# EAGLE design SingleSystem1 (EAGLE 7.7.0)
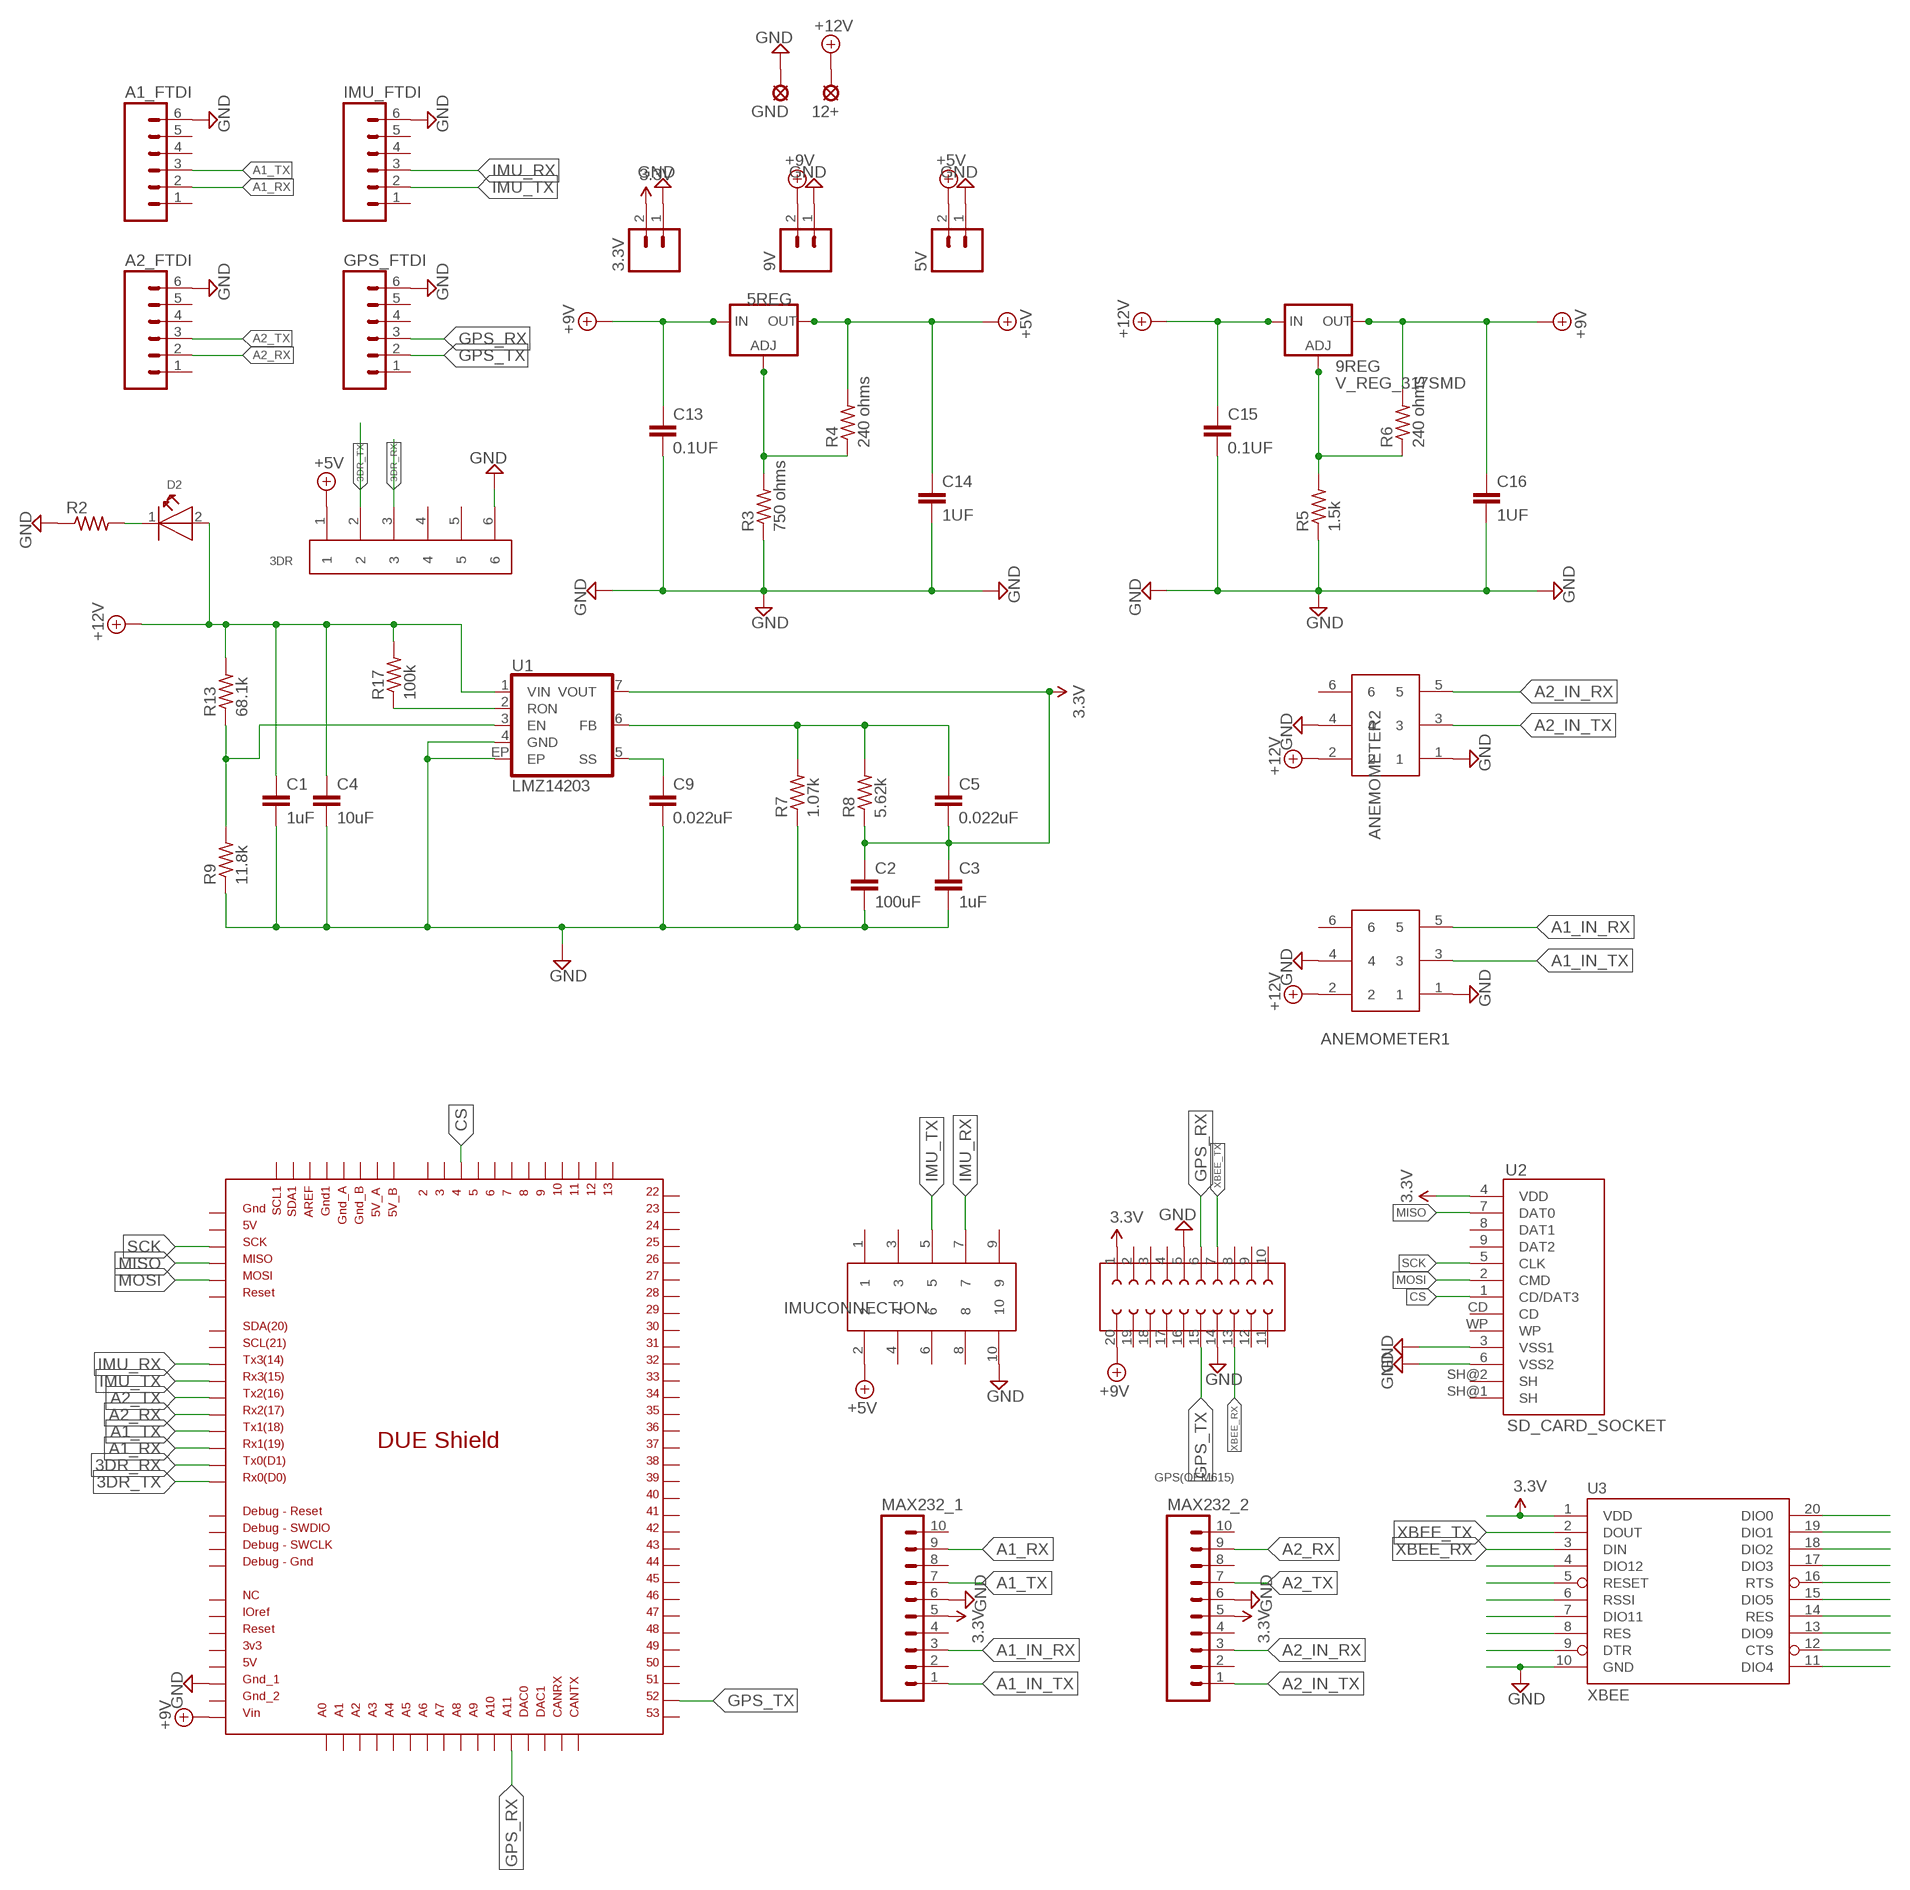
[diagram p0: schematic, sheet 1]

## Parts
3.3V  M02  [02P]
3DR  653006114822  [653006114822]
5REG  V_REG_317SMD  [SOT223]
5V  M02  [02P]
9REG  V_REG_317SMD  [SOT223]
9V  M02  [02P]
12+  SE14  [SE14]
A1_FTDI  M06  [06P]
A2_FTDI  M06  [06P]
ANEMOMETER1  61200622323  [61200622323]
ANEMOMETER2  61200622323  [61200622323]
C1  1uF  1UF-25V-10%(0805)  [0805]
C2  100uF  CAP1206  [1206]
C3  1uF  1UF-25V-10%(0805)  [0805]
C4  10uF  CAP0805  [0805]
C5  0.022uF  CAP0603-CAP  [0603-CAP]
C9  0.022uF  CAP0603-CAP  [0603-CAP]
C13  0.1UF  1UF-25V-10%(0805)  [0805]
C14  1UF  1UF-25V-10%(0805)  [0805]
C15  0.1UF  1UF-25V-10%(0805)  [0805]
C16  1UF  1UF-25V-10%(0805)  [0805]
D2  WL-SMCW-150120BS75000-B  [1206]
GND  SE14  [SE14]
GPS(OEM615)  62002021821  [62002021821]
GPS_FTDI  M06  [06P]
IMU_FTDI  M06  [06P]
IMUCONNECTION  62501021621  [62501021621]
MAX232_1  M10  [10P]
MAX232_2  M10  [10P]
R2  R-US_M2012  [M2012]
R3  750 ohms  R-US_M2012  [M2012]
R4  240 ohms  R-US_M2012  [M2012]
R5  1.5k  R-US_M2012  [M2012]
R6  240 ohms  R-US_M2012  [M2012]
R7  1.07k  R-US_M2012  [M2012]
R8  5.62k  R-US_M2012  [M2012]
R9  11.8k  R-US_M2012  [M2012]
R13  68.1k  R-US_M2012  [M2012]
R17  100k  R-US_M2012  [M2012]
U1  LMZ14203  [TO-PMOD-7]
U2  SD_CARD_SOCKET  [SD_1:1]
U3  XBEE  XBEE-1B1  [XBEE-1]
U$1  DUE(NORMAL)  [DUE(NORMAL)]

## Nets
3.3V: 3.3V.2 C2.1 C3.1 C5.2 GPS(OEM615).1 MAX232_1.5 MAX232_2.5 R8.1 U1.7(VOUT) U2.4(VDD) U3.1(VDD)
3DR_RX [3DR]: 3DR.3 U$1.TX0
3DR_TX [3DR]: 3DR.2 U$1.RX0
+5V: 3DR.1 5REG.2(OUT) 5V.2 C14.1 IMUCONNECTION.2 R4.2
+9V: 5REG.3(IN) 9REG.2(OUT) 9V.2 C13.1 C16.1 GPS(OEM615).20 R6.2 U$1.VIN
+12V: 9REG.3(IN) 12+.MP ANEMOMETER1.2 ANEMOMETER2.2 C1.1 C4.1 C15.1 D2.2(A) R13.2 R17.2 U1.1(VIN)
A1_IN_RX: ANEMOMETER1.5 MAX232_1.3
A1_IN_TX: ANEMOMETER1.3 MAX232_1.1
A1_RX: A1_FTDI.2 MAX232_1.9 U$1.RX1
A1_TX: A1_FTDI.3 MAX232_1.7 U$1.TX1
A2_IN_RX: ANEMOMETER2.5 MAX232_2.3
A2_IN_TX: ANEMOMETER2.3 MAX232_2.1
A2_RX: A2_FTDI.2 MAX232_2.9 U$1.RX2
A2_TX: A2_FTDI.3 MAX232_2.7 U$1.TX2
CS: U2.1(CD/DAT3) U$1.4
GND: 3.3V.1 3DR.6 5V.1 9V.1 A1_FTDI.6 A2_FTDI.6 ANEMOMETER1.1 ANEMOMETER1.4 ANEMOMETER2.1 ANEMOMETER2.4 C1.2 C2.2 C3.2 C4.2 C9.2 C13.2 C14.2 C15.2 C16.2 GND.MP GPS(OEM615).5 GPS(OEM615).14 GPS_FTDI.6 IMU_FTDI.6 IMUCONNECTION.10 MAX232_1.6 MAX232_2.6 R2.1 R3.1 R5.1 R7.1 R9.1 U1.4(GND) U1.EP U2.3(VSS1) U2.6(VSS2) U3.10(GND) U$1.GND_1
GPS_RX: GPS(OEM615).6 GPS_FTDI.3 U$1.A11
GPS_TX: GPS(OEM615).15 GPS_FTDI.2 U$1.52
IMU_RX: IMU_FTDI.3 IMUCONNECTION.7 U$1.TX3
IMU_TX: IMU_FTDI.2 IMUCONNECTION.5 U$1.RX3
MISO: U2.7(DAT0) U$1.MISO_ICSP
MOSI: U2.2(CMD) U$1.MOSI_ICSP
N$1: U3.5(RESET)
N$2: 5REG.1(ADJ) R3.2 R4.1
N$3: 9REG.1(ADJ) R5.2 R6.1
N$4: R9.2 R13.1 U1.3(EN)
N$5: R17.1 U1.2(RON)
N$6: C9.1 U1.5(SS)
N$7: D2.1(K) R2.2
N$8: C5.1 R7.2 R8.2 U1.6(FB)
N$24: U3.4(DIO12)
N$26: U3.6(RSSI)
N$27: U3.7(DIO11)
N$28: U3.8(RES)
N$29: U3.9(DTR)
N$31: U3.11(DIO4)
N$32: U3.12(CTS)
N$33: U3.13(DIO9)
N$34: U3.14(RES)
N$35: U3.15(DIO5)
N$36: U3.16(RTS)
N$37: U3.17(DIO3)
N$38: U3.18(DIO2)
N$39: U3.19(DIO1)
N$40: U3.20(DIO0)
SCK: U2.5(CLK) U$1.SCK_ICSP
XBEE_RX: GPS(OEM615).13 U3.3(DIN)
XBEE_TX: GPS(OEM615).7 U3.2(DOUT)
Unconnected: 3DR.4 3DR.5 A1_FTDI.1 A1_FTDI.4 A1_FTDI.5 A2_FTDI.1 A2_FTDI.4 A2_FTDI.5 ANEMOMETER1.6 ANEMOMETER2.6 GPS(OEM615).2 GPS(OEM615).3 GPS(OEM615).4 GPS(OEM615).8 GPS(OEM615).9 GPS(OEM615).10 GPS(OEM615).11 GPS(OEM615).12 GPS(OEM615).16 GPS(OEM615).17 GPS(OEM615).18 GPS(OEM615).19 GPS_FTDI.1 GPS_FTDI.4 GPS_FTDI.5 IMU_FTDI.1 IMU_FTDI.4 IMU_FTDI.5 IMUCONNECTION.1 IMUCONNECTION.3 IMUCONNECTION.4 IMUCONNECTION.6 IMUCONNECTION.8 IMUCONNECTION.9 MAX232_1.2 MAX232_1.4 MAX232_1.8 MAX232_1.10 MAX232_2.2 MAX232_2.4 MAX232_2.8 MAX232_2.10 U2.8(DAT1) U2.9(DAT2) U2.CD U2.SH@1(SH) U2.SH@2(SH) U2.WP U$1.2 U$1.3 U$1.3V3 U$1.5 U$1.5V U$1.5V_A U$1.5V_B U$1.5V_ICSP U$1.6 U$1.7 U$1.8 U$1.9 U$1.10 U$1.11 U$1.12 U$1.13 U$1.22 U$1.23 U$1.24 U$1.25 U$1.26 U$1.27 U$1.28 U$1.29 U$1.30 U$1.31 U$1.32 U$1.33 U$1.34 U$1.35 U$1.36 U$1.37 U$1.38 U$1.39 U$1.40 U$1.41 U$1.42 U$1.43 U$1.44 U$1.45 U$1.46 U$1.47 U$1.48 U$1.49 U$1.50 U$1.51 U$1.53 U$1.A0 U$1.A1 U$1.A2 U$1.A3 U$1.A4 U$1.A5 U$1.A6 U$1.A7 U$1.A8 U$1.A9 U$1.A10 U$1.AREF U$1.CANRX U$1.CANTX U$1.DAC0 U$1.DAC1 U$1.GND1 U$1.GND_2 U$1.GND_A U$1.GND_B U$1.GND_DEBUG U$1.GND_ICSP U$1.IOREF U$1.NC U$1.RESET U$1.RESET_DEBUG U$1.RESET_ICSP U$1.SCL U$1.SCL1 U$1.SDA U$1.SDA1 U$1.SWCLK_DEBUG U$1.SWDIO_DEBUG

## Library data of the parts
3.3V 5V 9V = con-amp-quick:M02: AMP QUICK CONNECTOR; OC_FARNELL: unknown; OC_NEWARK: unknown
3DR = Wire_to_Board_Connectors_rev15d:653006114822: WR-WTB 1.25mm Male Vertical Shrouded Header,6 Pins=>Code : Con_WTB_1.25_PCB_THT_653006114822 <http://katalog.we-online.de/media/thumbs2/eican/thb_Con_WTB_1.25_PCB_THT_6530xx114822_pf2.jpg> Details see: http://katalog.we-online.de/en/em/653_0xx_114_822 Created 2014-06-06, Karrer Zheng 2014 (C) Würth Elektronik; OC_NEWARK: unknown
5REG 9REG = SparkFun-PowerIC:V_REG_317: Voltage Regulator Standard LM317 adjustable voltage regulator. AOI (Adjust Output Input). Google 'LM317 Calculator' for easy to use app to get the two resistor values needed. 240/720 for 5V output. 240/390 for 3.3V output. Spark Fun Electronics SKU : COM-00527; OC_NEWARK: unknown
12+ GND = solpad:SE14: SOLDER PAD E1553, drill 1,4mm, distributor Buerklin, 07F820; OC_NEWARK: unknown
A1_FTDI A2_FTDI GPS_FTDI IMU_FTDI = con-amp-quick:M06: AMP QUICK CONNECTOR; OC_FARNELL: unknown; OC_NEWARK: unknown
ANEMOMETER1 ANEMOMETER2 = Wurth_Elektronik_Electromechanic_Wire_to_Board_Connectors_rev15c:61200622323: WR-BHD 2.54mm Board to Cable Transition Connector, 6 Pins=>Code : Con_WTB_IDC_61200622323 <http://katalog.we-online.de/media/thumbs2/eican/thb_Con_WTB_IDC_6120xx22323_pf2.jpg> Details see: http://katalog.we-online.de/en/em/612_0xx_223_23 Created 2014-06-05, Karrer Zheng 2014 (C) Würth Elektronik; OC_NEWARK: unknown
C1 C3 = SparkFun-Capacitors:1UF-25V-10%(0805): CAP-08064; MF: VISHAY/SPRAGUE; MPN: 1C10Z5U104M050R; OC_NEWARK: 66C6034; PROD_ID: CAP-08064
C2 C4 C5 C9 = SparkFun-Capacitors:CAP: Capacitor Standard 0603 ceramic capacitor, and 0.1" leaded capacitor.; OC_NEWARK: unknown
C13-C16 = SparkFun-Capacitors:1UF-25V-10%(0805): CAP-08064; OC_NEWARK: unknown; PROD_ID: CAP-08064; VALUE: 1uF
D2 = Wuerth_Elektronik_LEDs_rev15b:WL-SMCW: SMD mono-color Chip LED Characteristics Low energy consumption High reliability Low current requirement Fast switching No UV/IR radiation Smallest SMD package with exceptional brightness Top view Wide viewing angle PBC high-usage Applications Backlight for mobile and portable device keypads Indoor and outdoor message boards Flat backlight for LCDs, switches and symbols Display for industrial control systems and traffic Miniaturized color effects Pedestrian mark Optical indicators General lighting Toys <http://katalog.we-online.de/media/images/eipal/WL-SMCW_pf2.jpg> Details see: http://katalog.we-online.de/en/led/WL-SMCW?m Updated 2015-04-10 2015 (C) Wurth Elektronik; COMPANY-URL: http://www.we-online.de; CREATED-BY: Christin Otto; CREATED-DATE: APR 2013; DATASHEET-URL: http://katalog.we-online.de/en/led/WL-SMCW?m=t&sq=smcw&sp=&sp=http%3A%2F%2Fwww.we-online.de%2Fweb%2Fen%2Felectronic_components%2Fsearchpage_PBS.php%3Fsearch%3Dsmcw#vs_t2:2; MANUFACTURER: Würth Elektronik eiSos GmbH; OC_NEWARK: unknown
GPS(OEM615) = Board_to_Board_Connectors_rev15d:62002021821: WR-PHD 2.00mm Dual Socket Header, 20 Pins=>Code : Con_BTB_SHD_2.00_2_62002021821 <http://katalog.we-online.de/media/thumbs2/eican/thb_Con_BTB_SHD_2.00_2_6200xx21821_pf2.jpg> Details see: http://katalog.we-online.de/en/em/620_0xx_218_21 Created 2014-06-03, Karrer Zheng 2014 (C) Würth Elektronik
IMUCONNECTION = Wurth_Elektronik_Electromechanic_Wire_to_Board_Connectors_rev15c:62501021621: WR-BHD 2.00mm Male Box Header, 10 Pins=>Code : Con_WTB_BHD_2.00_Male_THT_62501021621 <http://katalog.we-online.de/media/thumbs2/eican/thb_Con_WTB_BHD_2.00_Male_THT_6250xx21621_pf2.jpg> Details see: http://katalog.we-online.de/en/em/625_0xx_216_21 Created 2014-06-05, Karrer Zheng 2014 (C) Würth Elektronik; OC_NEWARK: unknown
MAX232_1 MAX232_2 = con-amp-quick:M10: AMP QUICK CONNECTOR; OC_FARNELL: unknown; OC_NEWARK: unknown
R2 R7-R9 R13 R17 = resistor:R-US_: RESISTOR, American symbol; OC_NEWARK: unknown
R3-R6 = adafruit:R-US_: RESISTOR, American symbol; OC_NEWARK: unknown
U1 = SparkFun-PowerIC:LMZ14203: 3A, Simple Switcher Power Module with 42V Maximum Input; OC_NEWARK: unknown
U2 = SparkFun-Connectors:SD_CARD_SOCKET: SD Memory Card Connector, push-push normal type, CD enable, WP enable
U3 = SparkFun:XBEE-1; OC_NEWARK: unknown
U$1 = DUElib130425:DUE(NORMAL)

## Net classes
0 default: width 0.508 mm, drill 0.508 mm, clearance 0.432 mm
1 3DR: width 0.381 mm, drill 0.381 mm, clearance 0.381 mm

## Board
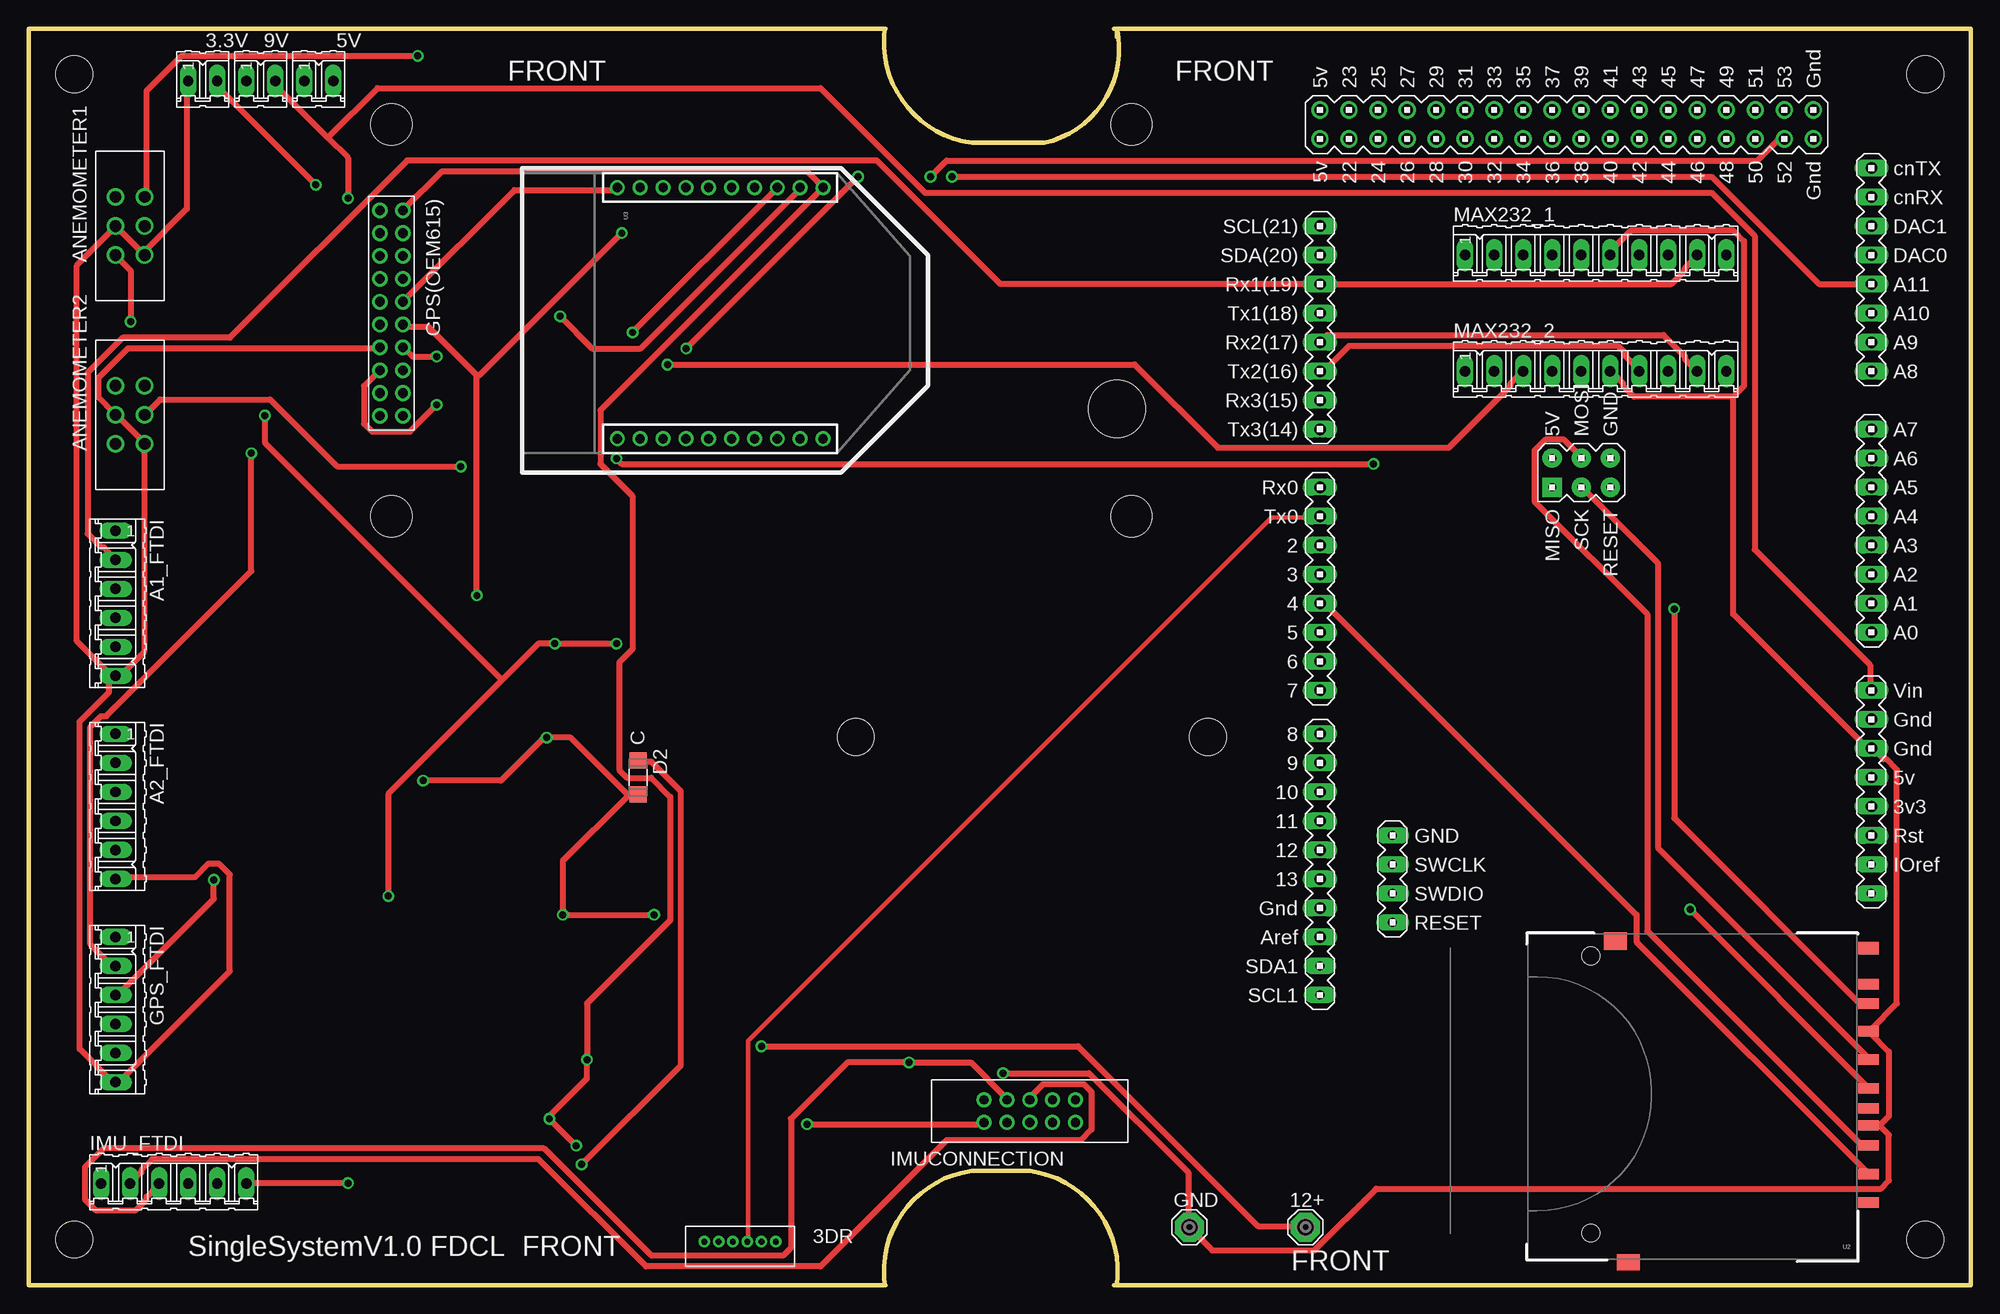
[diagram p1: board, top side]
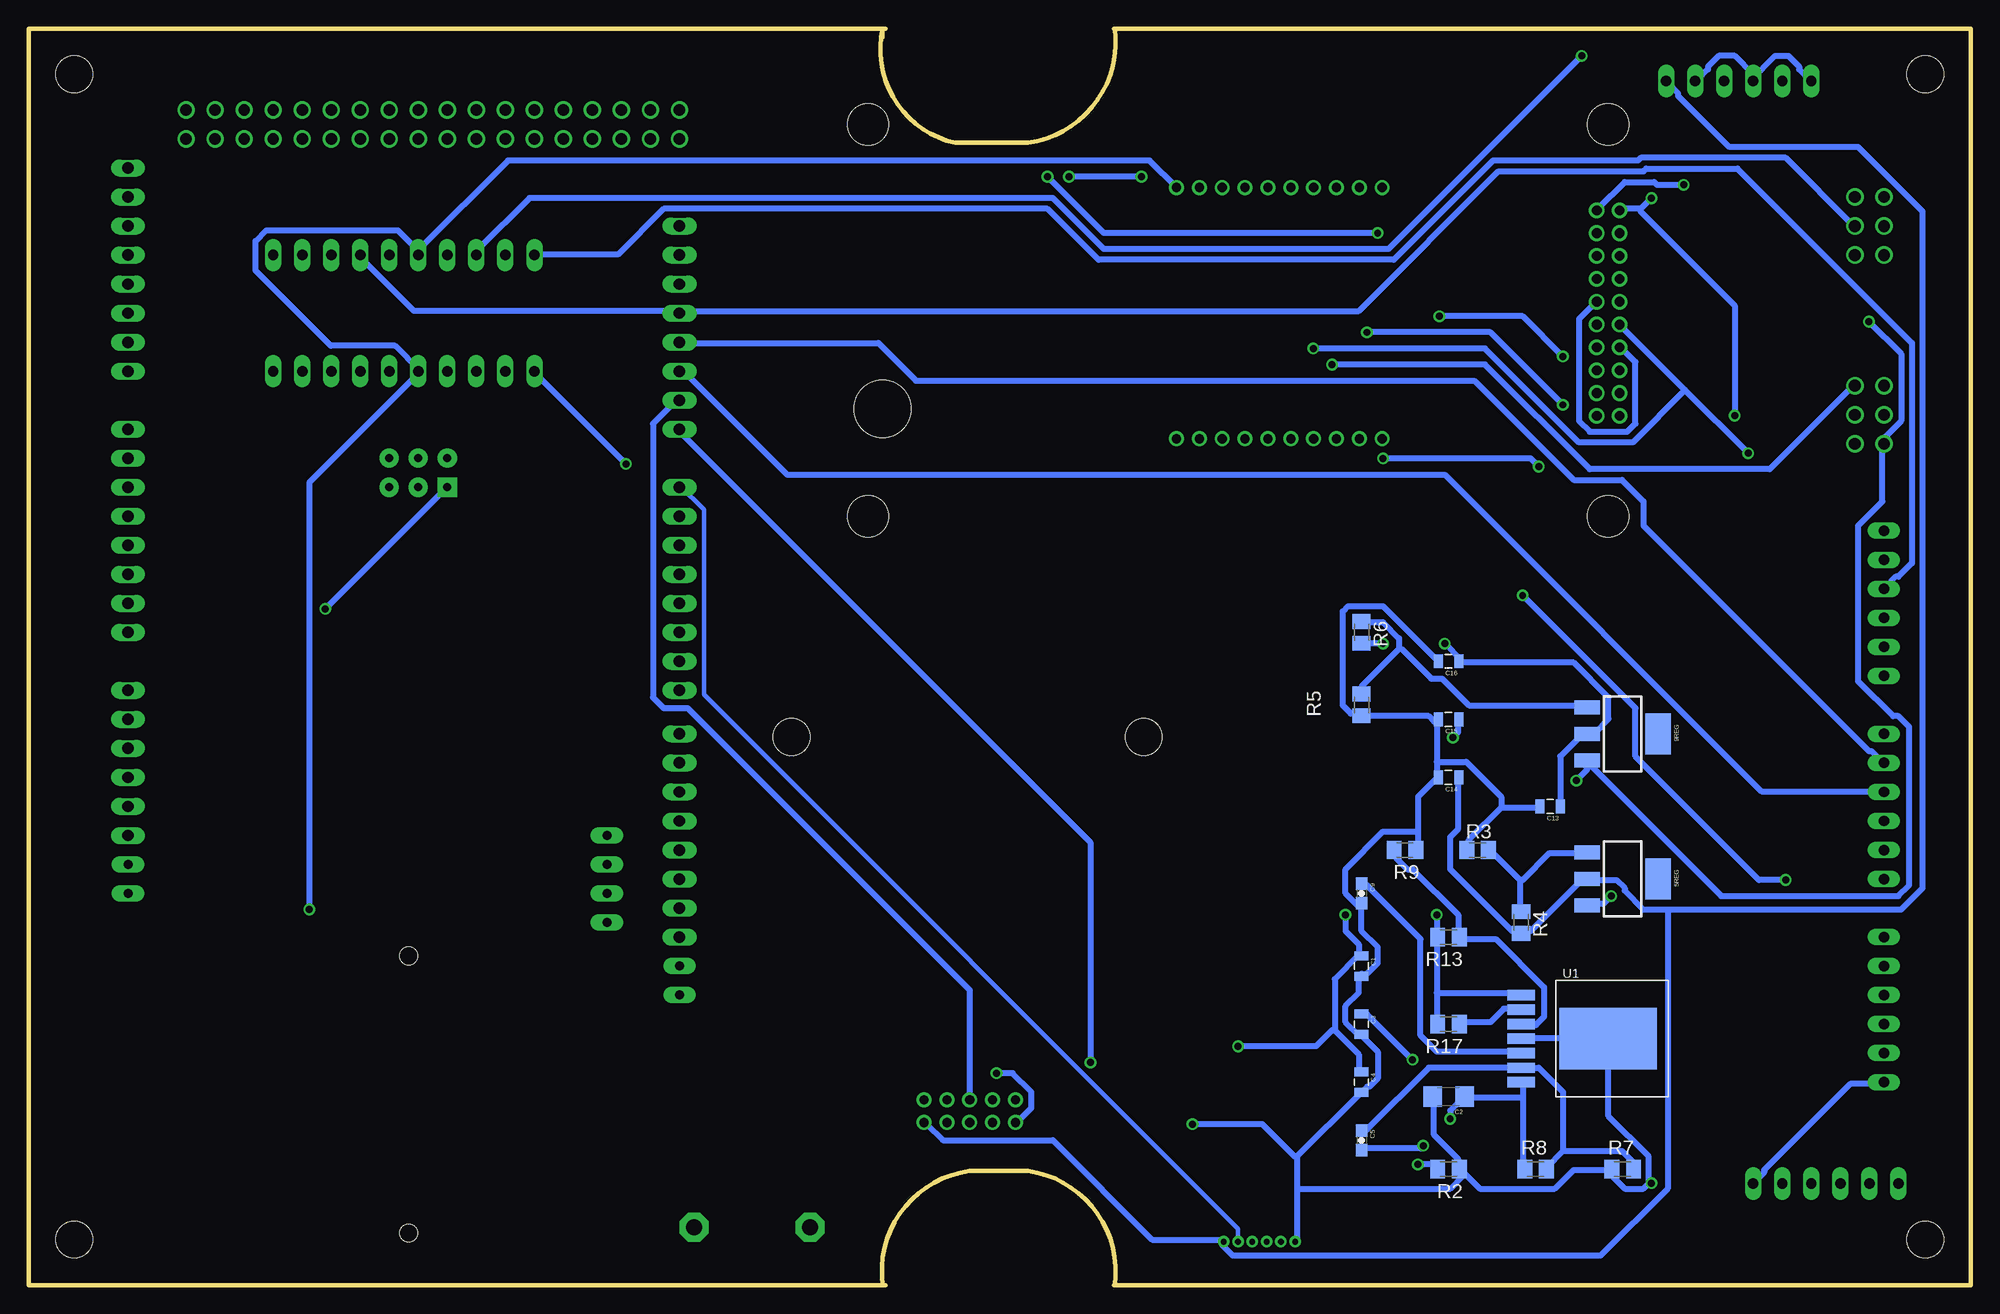
[diagram p2: board, bottom side, seen from below]

Size 170 x 110 mm. Coordinates in mm from the lower left corner, seen from the top.
Outline: 74.93,0 0,0 0,110 74.93,110
Outline: 74.93,0 75,0
Outline: 95.25,0 170,0 170,110 95.25,110
Outline: 95.25,0 95,0
Outline: 74.93,0 arc-90 82.55,10 87.63,10 arc-90 95.25,0
Outline: 74.93,110 75,110
Outline: 74.93,110 arc90 82.55,100 88.9,100 arc90 95.25,110
Outline: 95.25,110 95,110
Outline: 95.25,109.22 95.25,110
Copper layers (1*16): Top 0.035mm / dielectric 1.5mm / Bottom 0.035mm
Design rules "default": minimum track width 10mil, minimum drill 24mil, track to track 8mil, track to pad 8mil, pad to pad 8mil, via to via 8mil, smd to smd 8mil, copper to edge 40mil, drill to drill 8mil, minimum pad ring 10mil, minimum via ring 8mil, stop-mask expansion 4mil, vias tented up to drill 0mil, thermal gap 10mil
Holes 3.2 mm at 72.39,48 103.23,48 4,4 4,106 166,106 166,4
Holes 3.6 mm at 96.53,67.31 31.76,67.31 31.76,101.6 96.53,101.6
Holes 5 mm at 95.26,76.71

### Footprints (pad centres in the part's own frame; a part is rotated, then mirrored left to right if it is on the bottom)
02P = drill 0.914 long: 1 -1.27,0; 2 1.27,0
653006114822 = drill 0.5: 1 0.625,0; 2 -0.625,0; 3 -1.875,0; 4 -3.125,0; 5 -4.375,0; 6 -5.625,0
SOT223 = smd 1.219 x 2.235: 1 -2.311,-3.099; 2 0,-3.099; 3 2.311,-3.099 | smd 3.6 x 2.2: 4 0,3.099
SE14 = drill 1.397 pad 2.54 octagon: MP 0,0
06P = drill 0.914 long: 1 -6.35,0; 2 -3.81,0; 3 -1.27,0; 4 1.27,0; 5 3.81,0; 6 6.35,0
61200622323 = drill 1.02: 1 -2.54,-1.27; 2 -2.54,1.27; 3 0,-1.27; 4 0,1.27; 5 2.54,-1.27; 6 2.54,1.27
0805 = smd 0.8 x 1.2: 1 -0.9,0; 2 0.9,0
1206 = smd 1.6 x 1.8: 1 -1.4,0; 2 1.4,0
0603-CAP = smd 1.1 x 1: 1 -0.85,0; 2 0.85,0
1206' = smd 1.4 x 1.5: 1 -1.5,0; 2 1.5,0
62002021821 = drill 0.85: 1 -9,1; 2 -7,1; 3 -5,1; 4 -3,1; 5 -1,1; 6 1,1; 7 3,1; 8 5,1; 9 7,1; 10 9,1; 11 9,-1; 12 7,-1; 13 5,-1; 14 3,-1; 15 1,-1; 16 -1,-1; 17 -3,-1; 18 -5,-1; 19 -7,-1; 20 -9,-1
62501021621 = drill 0.8: 1 -4,-1; 2 -4,1; 3 -2,-1; 4 -2,1; 5 0,-1; 6 0,1; 7 2,-1; 8 2,1; 9 4,-1; 10 4,1
10P = drill 0.914 long: 1 -11.43,0; 2 -8.89,0; 3 -6.35,0; 4 -3.81,0; 5 -1.27,0; 6 1.27,0; 7 3.81,0; 8 6.35,0; 9 8.89,0; 10 11.43,0
M2012 = smd 1.3 x 1.6: 1 -0.95,0; 2 0.95,0
TO-PMOD-7 = smd 0.89 x 2.41: 1 -3.81,-7.63; 2 -2.54,-7.63; 3 -1.27,-7.63; 4 0,-7.63; 5 1.27,-7.63; 6 2.57,-7.63; 7 3.81,-7.63 | smd 5.35 x 8.54: EP 0,0
SD_1:1 = smd 1.8 x 0.9: 1 -1,6.77; 2 -1,4.27; 3 -1,2.52; 4 -1,-0.73; 5 -1,-3.23; 6 -1,-5.73; 7 -1,-8.15; 8 -1,-9.85; 9 -1,9.27; CD -1,1.02 | smd 2 x 1.4: SH@1 20,14.496 | smd 2 x 1.527: SH@2 21.15,-13.589 | smd 1.8 x 1.1: WP -1,-13 | hole 1.55: 23.3,11.94; 23.3,-12.32
XBEE-1 = drill 0.8: 1 -11,20; 2 -11,18; 3 -11,16; 4 -11,14; 5 -11,12; 6 -11,10; 7 -11,8; 8 -11,6; 9 -11,4; 10 -11,2; 11 11,2; 12 11,4; 13 11,6; 14 11,8; 15 11,10; 16 11,12; 17 11,14; 18 11,16; 19 11,18; 20 11,20
DUE(NORMAL) = drill 1 long: 2 -16.51,30.48; 3 -19.05,30.48; 3V3 -39.37,-17.78; 4 -21.59,30.48; 5 -24.13,30.48; 5V -36.83,-17.78; 6 -26.67,30.48; 7 -29.21,30.48; 8 -33.02,30.48; 9 -35.56,30.48; 10 -38.1,30.48; 11 -40.64,30.48; 12 -43.18,30.48; 13 -45.72,30.48; A0 -24.13,-17.78; A1 -21.59,-17.78; A2 -19.05,-17.78; A3 -16.51,-17.78; A4 -13.97,-17.78; A5 -11.43,-17.78; A6 -8.89,-17.78; A7 -6.35,-17.78; A8 -1.27,-17.78; A9 1.27,-17.78; A10 3.81,-17.78; A11 6.35,-17.78; AREF -50.8,30.48; AREF1 -50.8,30.48; CANRX 13.97,-17.78; CANTX 16.51,-17.78; DAC0 8.89,-17.78; DAC1 11.43,-17.78; GND1 -48.26,30.48; GND_1 -34.29,-17.78; GND_2 -31.75,-17.78; RESET -41.91,-17.78; RX0 -11.43,30.48; RX1 6.35,30.48; RX2 1.27,30.48; RX3 -3.81,30.48; SCL 11.43,30.48; SDA 8.89,30.48; TX0 -13.97,30.48; TX1 3.81,30.48; TX2 -1.27,30.48; TX3 -6.35,30.48; VIN -29.21,-17.78 | drill 1: 5V_A 19.05,30.48; 5V_B 21.59,30.48; 22 19.05,27.94; 23 21.59,27.94; 24 19.05,25.4; 25 21.59,25.4; 26 19.05,22.86; 27 21.59,22.86; 28 19.05,20.32; 29 21.59,20.32; 30 19.05,17.78; 31 21.59,17.78; 32 19.05,15.24; 33 21.59,15.24; 34 19.05,12.7; 35 21.59,12.7; 36 19.05,10.16; 37 21.59,10.16; 38 19.05,7.62; 39 21.59,7.62; 40 19.05,5.08; 41 21.59,5.08; 42 19.05,2.54; 43 21.59,2.54; 44 19.05,0; 45 21.59,0; 46 19.05,-2.54; 47 21.59,-2.54; 48 19.05,-5.08; 49 21.59,-5.08; 50 19.05,-7.62; 51 21.59,-7.62; 52 19.05,-10.16; 53 21.59,-10.16; GND_A 19.05,-12.7; GND_B 21.59,-12.7 | drill 0.7 pad 1.676: 5V_ICSP -8.89,5.08; GND_ICSP -8.89,10.16; MOSI_ICSP -8.89,7.62; RESET_ICSP -11.43,5.08; SCK_ICSP -11.43,7.62 | drill 0.8 pad 1.422 long: GND_DEBUG -41.91,24.13; IOREF -44.45,-17.78; NC -46.99,-17.78; RESET_DEBUG -49.53,24.13; SCL1 -55.88,30.48; SDA1 -53.34,30.48; SWCLK_DEBUG -44.45,24.13; SWDIO_DEBUG -46.99,24.13 | drill 0.7 pad 1.676 square: MISO_ICSP -11.43,10.16

### Placement (x,y rotation side)
3.3V  15.24,105.41 0 top
3DR  64.77,3.81 0 top
5REG  30.48,35.56 270 bottom
5V  25.4,105.41 0 top
9REG  30.48,48.26 270 bottom
9V  20.32,105.41 0 top
12+  111.76,5.08 0 top
A1_FTDI  7.62,59.69 270 top
A2_FTDI  7.62,41.91 270 top
ANEMOMETER1  8.89,92.71 90 top
ANEMOMETER2  8.89,76.2 90 top
C1  53.34,27.94 270 bottom
C2  45.72,16.51 180 bottom
C3  53.34,22.86 270 bottom
C4  53.34,17.78 270 bottom
C5  53.34,12.7 270 bottom
C9  53.34,34.29 270 bottom
C13  36.83,41.91 180 bottom
C14  45.72,44.45 180 bottom
C15  45.72,49.53 180 bottom
C16  45.72,54.61 180 bottom
D2  [1206']  53.34,44.45 270 top
GND  101.6,5.08 0 top
GPS(OEM615)  31.75,85.09 270 top
GPS_FTDI  7.62,24.13 270 top
IMU_FTDI  12.7,8.89 0 top
IMUCONNECTION  87.63,15.24 180 top
MAX232_1  137.16,90.17 0 top
MAX232_2  137.16,80.01 0 top
R2  45.72,10.16 180 bottom
R3  43.18,38.1 0 bottom
R4  39.37,31.75 270 bottom
R5  53.34,50.8 90 bottom
R6  53.34,57.15 270 bottom
R7  30.48,10.16 0 bottom
R8  38.1,10.16 0 bottom
R9  49.53,38.1 180 bottom
R13  45.72,30.48 180 bottom
R17  45.72,22.86 180 bottom
U1  31.75,21.59 270 bottom
U2  160.02,16.51 180 top
U3  49.53,85.09 270 top
U$1  143.51,81.28 90 top

### Tracks (layer width: path | path; a pad name or v marks a point on that pad's centre or on a via)
3.3V  (via drill 0.61)
  Top 0.508: v145.43,32.89 160.94,17.39 U2.4 | v47.93,12.22 v45.58,14.57 45.58,14.8 48.87,18.09 v48.87,19.74 48.87,24.67 56.15,31.95 56.15,42.76 54.51,44.41 52.39,44.41 51.69,45.11 51.69,54.51 52.86,55.68 52.86,69.08 50.04,71.89 50.04,76.59 69.31,95.86 U3.1 69.31,96.09 69.31,96.33 68.14,97.5 36.18,97.5 32.89,94.22 GPS(OEM615).1 | v25.14,96.33 16.68,104.79 16.68,105.26 3.3V.2
  Bottom 0.508: v145.43,32.89 145.43,70.25 135.8,79.88 MAX232_2.5 135.8,80.12 137.92,82.23 143.55,82.23 150.13,88.81 150.13,91.4 149.19,92.33 137.68,92.33 136.04,90.69 136.04,90.22 MAX232_1.5 135.8,90.69 128.05,98.44 71.89,98.44 69.55,96.09 U3.1 | 39.24,16.45 39.24,17.62 U1.7 | 39.24,16.45 39.24,10.34 R8.1 | v47.93,12.22 48.16,11.98 53.33,11.98 C5.2 | v45.58,14.57 45.58,15.27 44.41,16.45 C2.1 44.17,16.45 39.24,16.45 | v48.87,19.74 52.86,23.73 53.33,23.73 C3.1 | v25.14,96.33 27.49,96.33 27.72,96.56 30.31,96.56 32.66,94.22 GPS(OEM615).1
3DR_RX
  Top 0.381: 3DR.3 62.97,3.99 62.97,21.38 108.78,67.2 113.01,67.2 U$1.TX0
3DR_TX
  Bottom 0.381: 3DR.2 64.14,3.99 64.14,4.93 110.9,51.69 110.9,67.9 113.01,70.02 U$1.RX0
+5V
  Bottom 0.508: IMUCONNECTION.2 91.4,14.1 89.99,12.69 80.35,12.69 71.66,3.99 65.55,3.99 3DR.1 65.55,3.76 65.55,3.52 64.61,2.58 32.42,2.58 26.55,8.46 26.55,32.89 | C14.1 44.88,44.41 44.88,39.94 45.58,39.24 45.58,36.42 40.18,31.01 39.47,31.01 R4.2 39.24,31.01 38.53,31.01 34.07,35.48 33.6,35.48 5REG.2 33.36,35.48 31.01,35.48 30.31,34.77 30.31,34.54 28.66,32.89 26.55,32.89 | 26.55,32.89 6.11,32.89 4.23,34.77 4.23,93.98 9.87,99.62 21.14,99.62 25.61,104.08 25.61,104.32 26.55,105.26 5V.2
+9V  (via drill 0.61)
  Top 0.508: v51.45,56.15 v46.05,56.15 44.64,56.15 41.47,52.98 | v31.48,34.07 31.48,43 41.47,52.98 | v27.96,95.16 27.96,98.68 26.2,100.44 | 26.2,100.44 21.38,105.26 9V.2 | 26.2,100.44 30.54,104.79 69.31,104.79 78.47,95.62 147.31,95.62 151.07,91.86 151.07,64.38 161.18,54.27 161.18,52.16 U$1.VIN | 41.47,52.98 20.68,73.77 v20.68,76.12
  Bottom 0.508: C13.1 35.95,42.06 35.95,46.28 34.07,48.16 33.6,48.16 9REG.2 33.36,48.4 32.89,48.4 31.72,49.57 31.72,51.45 34.77,54.51 44.64,54.51 C16.1 44.64,54.74 v46.05,56.15 | v51.45,56.15 53.33,56.15 R6.2 | v31.48,34.07 32.19,33.36 33.36,33.36 5REG.3 | 28.9,94.22 30.54,94.22 GPS(OEM615).20 | v27.96,95.16 28.9,94.22 | v20.68,76.12 20.68,85.76 28.9,93.98 28.9,94.22
+12V  (via drill 0.61)
  Top 0.508: v64.14,20.91 91.86,20.91 107.61,5.17 111.6,5.17 12+.MP | v8.93,84.35 8.93,88.81 7.75,89.99 ANEMOMETER1.2 | 52.39,43 47.46,47.93 v45.34,47.93 45.11,47.93 41.35,44.17 v34.54,44.17 | 52.39,43 53.33,43 D2.2 | 52.39,43 52.39,42.76 46.76,37.12 v46.76,32.42 v54.74,32.42
  Bottom 0.508: 55.68,22.32 53.57,20.21 53.57,18.8 C4.1 | 55.68,22.32 55.68,26.78 53.57,28.9 C1.1 53.57,29.13 53.57,29.84 54.74,31.01 v54.74,32.42 | v64.14,20.91 57.33,20.91 55.92,22.32 55.68,22.32 | v8.93,84.35 6.11,81.53 6.11,75.65 7.52,74.24 7.52,73.77 ANEMOMETER2.2 7.75,73.54 7.75,68.61 9.87,66.49 9.87,52.86 6.81,49.81 6.34,49.81 5.4,48.87 5.4,35.01 6.34,34.07 21.85,34.07 33.36,45.58 9REG.3 33.6,45.81 33.6,45.11 v34.54,44.17 | 46.76,25.61 46.76,30.31 R13.2 46.76,30.54 v46.76,32.42 | 46.76,25.61 46.76,23.02 R17.2 | 46.76,25.61 39.47,25.61 U1.1 | v45.34,47.93 44.88,48.4 44.88,49.34 C15.1
A1_IN_RX  (via drill 0.61)
  Top 0.508: v34.07,107.61 13.39,107.61 10.34,104.55 10.34,95.39 ANEMOMETER1.5
  Bottom 0.508: v34.07,107.61 50.98,90.69 75.89,90.69 80.35,95.16 126.17,95.16 130.63,90.69 130.63,90.22 MAX232_1.3
A1_IN_TX
  Bottom 0.508: MAX232_1.1 125.7,90.22 118.42,90.22 114.42,94.22 80.82,94.22 76.36,89.75 50.51,89.75 41.82,98.44 29.13,98.44 28.9,98.68 16.21,98.68 10.34,92.81 ANEMOMETER1.3
A1_RX
  Top 0.508: A1_FTDI.2 7.52,63.67 6.58,64.61 6.34,64.61 5.17,65.79 5.17,79.88 8.22,82.94 17.62,82.94 33.13,98.44 74.24,98.44 85.05,87.64 113.01,87.64 U$1.RX1 113.25,87.64 143.79,87.64 144.96,88.81 144.96,89.05 145.9,89.99 MAX232_1.9
A1_TX
  Bottom 0.508: A1_FTDI.3 7.52,61.09 6.58,62.03 6.34,62.03 5.17,63.2 5.17,82.47 20.44,97.74 28.43,97.74 28.66,97.5 41.35,97.5 53.57,85.29 113.01,85.29 U$1.TX1 113.25,85.29 136.27,85.29 140.97,89.99 MAX232_1.7
A2_IN_RX  (via drill 0.61)
  Top 0.508: v55.92,80.59 96.8,80.59 104.08,73.3 124.29,73.3 129.69,78.71 129.69,78.94 130.63,79.88 MAX232_2.3
  Bottom 0.508: v55.92,80.59 42.53,80.59 33.36,71.42 17.62,71.42 10.34,78.71 ANEMOMETER2.5
A2_IN_TX  (via drill 0.61)
  Top 0.508: v117.71,71.89 51.92,71.89 v51.45,72.36 | v37.83,71.66 27.02,71.66 21.14,77.53 11.51,77.53 10.34,76.36 ANEMOMETER2.3
  Bottom 0.508: v117.71,71.89 125.7,79.88 MAX232_2.1 | v51.45,72.36 38.53,72.36 v37.83,71.66
A2_RX
  Top 0.508: MAX232_2.9 145.9,80.12 144.96,81.06 144.96,81.29 143.09,83.17 113.72,83.17 113.25,82.7 U$1.RX2
  Bottom 0.508: A2_FTDI.2 7.75,45.81 8.69,46.76 8.93,46.76 28.66,66.49 28.66,68.61 30.54,70.48 34.77,70.48 43.47,79.18 92.33,79.18 95.62,82.47 113.01,82.47 U$1.RX2
A2_TX
  Top 0.508: MAX232_2.7 140.97,80.12 139.79,81.29 139.79,81.53 139.09,82.23 115.59,82.23 113.25,79.88 U$1.TX2
  Bottom 0.508: A2_FTDI.3 7.75,43.23 18.33,43.23 46.05,70.95 103.61,70.95 112.54,79.88 113.01,79.88 U$1.TX2
CS
  Top 0.508: U2.1 160.94,9.87 140.74,30.07 140.74,32.42 113.25,59.91 U$1.4
GND  (via drill 0.61)
  Top 0.508: 149.19,77.77 140.5,77.77 139.56,78.71 139.56,78.94 138.62,79.88 MAX232_2.6 | 149.19,77.77 150.13,78.71 150.13,91.4 149.19,92.33 140.26,92.33 138.62,90.69 138.62,90.22 MAX232_1.6 | 162.12,14.1 161.18,14.1 U2.3 | 162.12,14.1 162.82,14.8 162.82,20.44 161.18,22.09 U2.6 161.18,22.32 163.53,24.67 163.53,45.11 162.59,46.05 162.35,46.05 161.41,46.99 U$1.GND_1 161.18,46.76 149.19,58.74 149.19,77.77 | 3.3V.1 13.86,105.26 13.86,94.22 10.1,90.46 ANEMOMETER1.1 10.1,90.22 7.75,92.57 ANEMOMETER1.4 7.52,92.57 4.23,89.28 4.23,56.39 7.05,53.57 7.52,53.57 A1_FTDI.6 | A1_FTDI.6 7.75,53.57 8.22,53.57 10.1,55.45 10.1,73.54 ANEMOMETER2.1 10.1,73.77 7.75,76.12 ANEMOMETER2.4 7.52,76.36 6.11,77.77 6.11,79.41 8.69,82 30.54,82 GPS(OEM615).14 | U3.10 51.45,95.86 42.53,95.86 32.89,86.23 GPS(OEM615).5 | A2_FTDI.6 7.75,35.71 14.57,35.71 15.74,36.89 16.68,36.89 17.62,35.95 17.62,27.49 7.75,17.62 GPS_FTDI.6 7.52,17.62 4.46,20.68 4.46,49.34 7.05,51.92 7.05,53.33 A1_FTDI.6 | v68.14,14.1 83.41,14.1 IMUCONNECTION.10 | v85.29,18.56 92.81,18.56 101.5,9.87 101.5,5.17 GND.MP 101.73,4.93 103.61,3.05 112.54,3.05 117.94,8.46 162.12,8.46 162.82,9.16 162.82,13.16 162.12,13.86 162.12,14.1 | v27.96,8.93 19.27,8.93 IMU_FTDI.6
  Bottom 0.508: 3.3V.1 14.1,105.49 15.04,106.43 15.04,106.67 15.98,107.61 17.15,107.61 19.27,105.49 9V.1 19.03,105.96 20.68,107.61 22.09,107.61 23.02,106.67 23.02,106.43 23.96,105.49 5V.1 | GPS(OEM615).14 30.54,82 29.37,80.82 29.37,75.42 30.07,74.71 33.36,74.71 34.3,75.65 34.3,84.58 32.89,85.99 GPS(OEM615).5 | IMU_FTDI.6 19.03,8.93 18.09,9.87 18.09,10.1 10.57,17.62 7.75,17.62 GPS_FTDI.6 | C16.2 46.76,54.74 51.45,59.44 54.51,59.44 54.98,58.97 54.98,50.75 54.27,50.04 53.57,50.04 R5.1 53.1,49.81 47.46,49.81 46.99,49.34 C15.2 46.76,49.34 46.76,45.81 | 41.12,41.82 37.83,41.82 C13.2 | 41.12,41.82 43.94,39 43.94,38.3 R3.1 | 46.76,45.81 46.76,44.64 C14.2 46.76,44.41 48.4,42.76 48.4,39.71 | 48.4,39.71 48.4,38.3 R9.1 | 41.12,41.82 41.12,42.76 44.17,45.81 46.76,45.81 | U1.4 39.24,21.61 31.95,21.61 U1.EP 31.72,21.38 31.72,14.8 28.19,11.28 28.19,8.93 | R2.1 44.64,10.1 43,8.46 36.42,8.46 34.77,10.1 31.48,10.1 R7.1 31.72,9.87 30.31,8.46 28.66,8.46 28.19,8.93 | C2.2 46.99,16.45 46.99,13.16 44.88,11.04 44.88,10.34 R2.1 | 58.97,11.28 58.97,8.46 | 58.97,8.46 58.97,3.99 3DR.6 | 58.97,11.28 53.57,16.68 C4.2 53.33,16.92 52.86,17.39 52.63,17.39 51.92,18.09 51.92,20.44 53.33,21.85 C3.2 53.57,21.85 54.74,23.02 54.74,24.43 53.57,25.61 53.57,27.02 C1.2 53.33,27.25 52.86,27.25 51.92,28.19 51.92,29.6 53.33,31.01 53.33,33.36 C9.2 53.57,33.13 54.74,34.3 54.74,36.42 51.45,39.71 48.4,39.71 | v68.14,14.1 62.03,14.1 59.21,11.28 58.97,11.28 | v85.29,18.56 83.88,18.56 82.23,16.92 82.23,15.51 83.41,14.33 IMUCONNECTION.10 | 58.97,8.46 45.58,8.46 44.41,9.63 R2.1 | v27.96,8.93 28.19,8.93
GPS_RX  (via drill 0.61)
  Top 0.508: 39.24,79.65 35.01,83.88 32.89,83.88 GPS(OEM615).6 | v39.24,60.38 39.24,79.65 | v16.21,35.48 16.21,33.83 7.75,25.38 GPS_FTDI.3 | v80.82,97.03 147.31,97.03 156.71,87.64 161.18,87.64 U$1.A11 | v51.92,92.1 39.47,79.65 39.24,79.65
  Bottom 0.508: v39.24,60.38 29.37,50.51 29.37,46.28 18.56,35.48 v16.21,35.48 | v80.82,97.03 75.89,92.1 v51.92,92.1
GPS_TX  (via drill 0.61)
  Top 0.508: v19.5,72.83 19.5,62.5 6.81,49.81 6.34,49.81 5.4,48.87 5.4,29.84 7.52,27.72 GPS_FTDI.2 | v78.94,97.03 80.35,98.44 151.31,98.44 153.19,100.32 153.66,100.32 U$1.52 | v57.56,82 v72.6,97.03
  Bottom 0.508: v19.5,72.83 25.02,78.36 | 25.02,78.36 30.54,83.88 GPS(OEM615).15 | v72.6,97.03 v78.94,97.03 | v57.56,82 42.53,82 34.3,73.77 29.6,73.77 25.02,78.36
IMU_RX  (via drill 0.61)
  Top 0.508: IMUCONNECTION.7 85.52,16.45 82.47,19.5 v77.06,19.5 71.66,19.5 66.73,14.57 66.73,3.29 66.02,2.58 54.51,2.58 45.11,11.98 6.58,11.98 4.93,10.34 4.93,7.52 5.87,6.58 9.4,6.58 10.34,7.52 10.34,7.75 11.28,8.69 IMU_FTDI.3
  Bottom 0.508: v77.06,19.5 77.06,38.77 113.01,74.71 U$1.TX3
IMU_TX
  Top 0.508: IMU_FTDI.2 9.87,9.87 9.87,10.1 10.81,11.04 44.64,11.04 54.04,1.65 69.31,1.65 80.35,12.69 92.1,12.69 93.04,13.63 93.04,16.92 92.33,17.62 88.81,17.62 87.64,16.45 IMUCONNECTION.5
  Bottom 0.508: IMUCONNECTION.5 87.64,16.45 87.64,25.84 112.31,50.51 114.42,50.51 115.36,51.45 115.36,75.42 113.25,77.53 U$1.RX3
MISO  (via drill 0.61)
  Top 0.508: v144.02,59.21 144.02,40.88 160.24,24.67 160.94,24.67 U2.7
  Bottom 0.508: v144.02,59.21 133.45,69.78 U$1.MISO_ICSP
MOSI
  Top 0.508: U2.2 160.94,12.45 160.24,12.45 141.68,31.01 141.68,58.74 131.81,68.61 131.81,73.07 132.75,74.01 134.39,74.01 135.8,72.6 U$1.MOSI_ICSP
N$2
  Bottom 0.508: 39.47,35.48 39.47,32.89 R4.1 | 39.47,35.48 42.06,38.06 R3.2 | 5REG.1 33.6,37.83 36.89,37.83 39.24,35.48 39.47,35.48
N$3
  Bottom 0.508: 50.04,55.68 53.33,52.39 53.33,51.92 R5.2 | 50.04,55.68 50.04,56.62 51.45,58.03 53.33,58.03 R6.1 | 9REG.1 33.6,50.75 43.94,50.75 46.28,53.1 47.23,53.1 49.81,55.68 50.04,55.68
N$4
  Bottom 0.508: R9.2 50.28,38.06 50.28,37.36 49.34,36.42 48.87,36.42 44.88,32.42 44.88,30.54 R13.1 44.64,30.31 41.59,30.31 37.36,26.08 37.36,23.5 38.06,22.79 39.24,22.79 U1.3
N$5
  Bottom 0.508: R17.1 44.64,23.02 42.06,23.02 40.88,24.2 39.47,24.2 U1.2
N$6
  Bottom 0.508: C9.1 53.33,35.01 52.86,35.01 48.16,30.31 48.16,21.85 46.76,20.44 39.47,20.44 U1.5
N$7  (via drill 0.61)
  Top 0.508: v48.4,10.57 57.09,19.27 57.09,43.23 54.51,45.81 53.57,45.81 D2.1
  Bottom 0.508: v48.4,10.57 46.99,10.57 46.76,10.34 R2.2
N$8
  Bottom 0.508: 35.71,11.75 30.54,11.75 29.6,10.81 29.6,10.34 R7.2 | 35.71,11.75 37.12,10.34 R8.2 | C5.1 53.33,13.63 52.86,13.63 47.46,19.03 39.47,19.03 U1.6 39.24,19.03 37.83,19.03 35.71,16.92 35.71,11.75
SCK
  Top 0.508: U2.5 160.94,19.97 142.62,38.3 142.62,63.2 136.04,69.78 U$1.SCK_ICSP
XBEE_RX  (via drill 0.61)
  Top 0.508: v52.86,83.41 65.32,95.86 U3.3 | v35.71,77.06 33.36,74.71 30.07,74.71 29.37,75.42 29.37,78.71 30.54,79.88 GPS(OEM615).13
  Bottom 0.508: v52.86,83.41 42.06,83.41 v35.71,77.06
XBEE_TX  (via drill 0.61)
  Top 0.508: v46.52,84.82 49.34,82 53.57,82 67.43,95.86 U3.2 | v35.71,81.29 33.6,81.29 32.89,82 GPS(OEM615).7
  Bottom 0.508: v46.52,84.82 39.24,84.82 v35.71,81.29

### Text on the board
tPlace: FRONT | FRONT | SingleSystemV1.0 FDCL | FRONT | FRONT